# Altium schematic sheet DesignSchematic.SchDoc
size A4
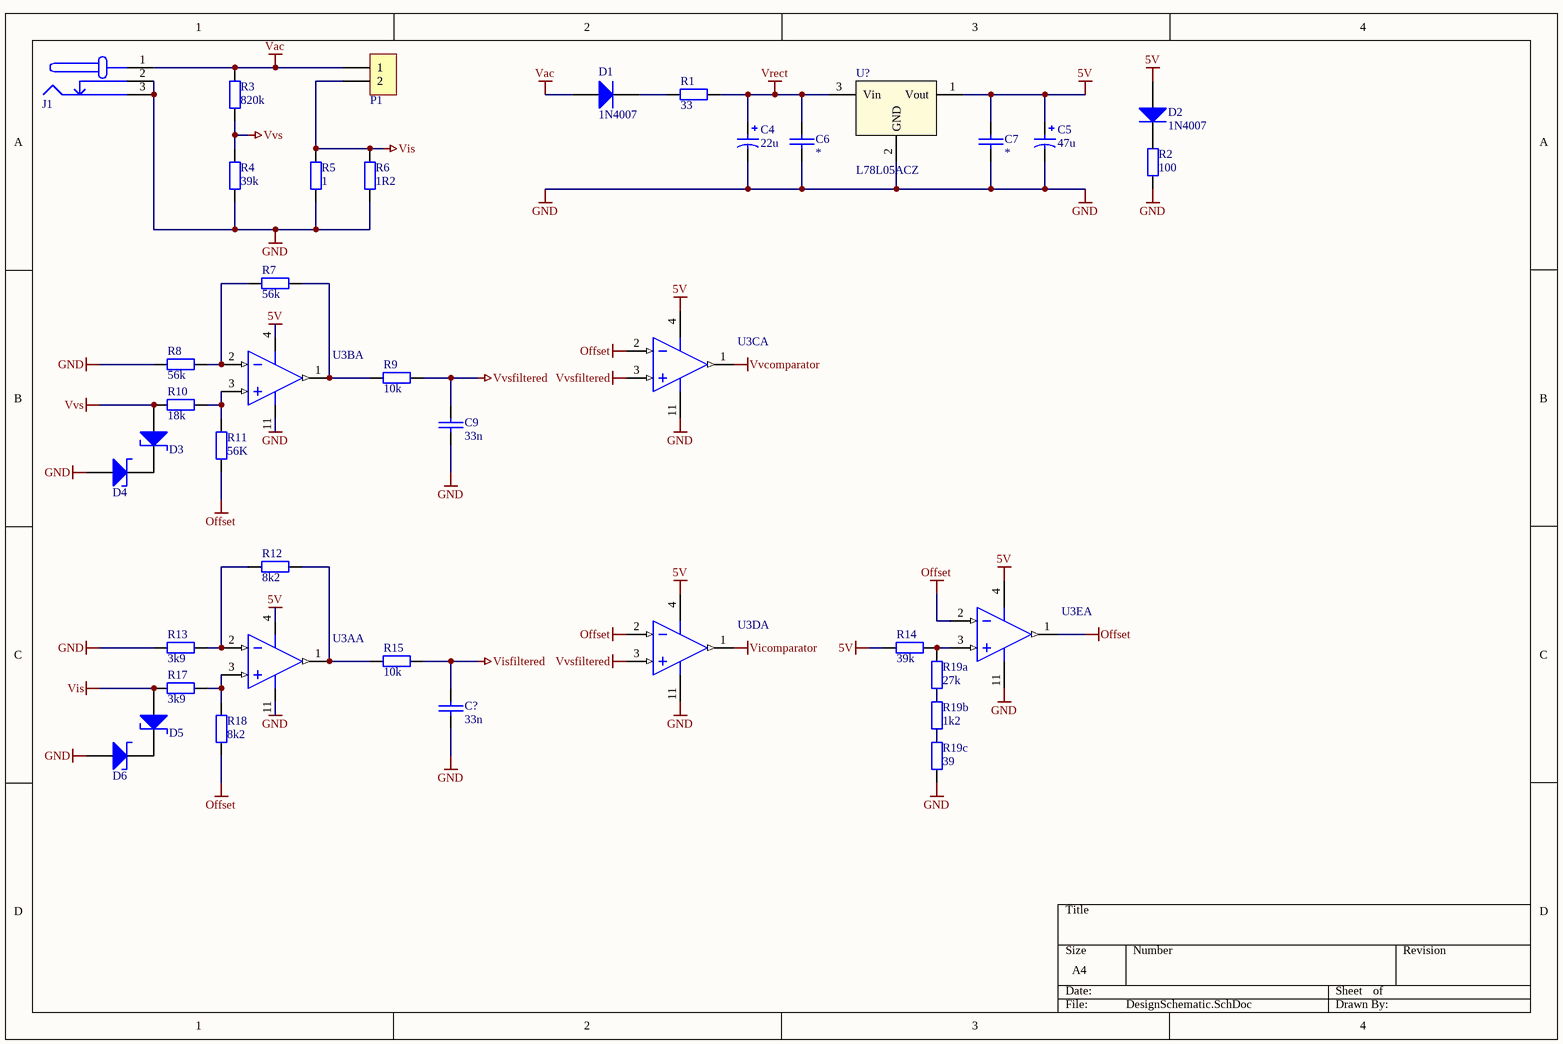
[diagram p0: DesignSchematic.SchDoc]

## Parts
C4  22u  [CAP-RAD-2.5mm Pitch]
C5  47u  [CAP-RAD-2.5mm Pitch]
C6  *  [CCAP-5P0]
C7  *  [CCAP-5P0]
C9  33n  [CCAP-5P0]
C?  33n  [CCAP-5P0]
D1  1N4007  [1N4007-MFG]
D2  1N4007  [1N4007-MFG]
D3  BZX79-CXVX  [AXIAL-Zener-0.4]  (value not drawn)
D4  BZX79-CXVX  [AXIAL-Zener-0.4]  (value not drawn)
D5  BZX79-CXVX  [AXIAL-Zener-0.4]  (value not drawn)
D6  BZX79-CXVX  [AXIAL-Zener-0.4]  (value not drawn)
J1  DC barrel jack  [AC-Socket]  (value not drawn)
P1  Dual Banana Plugs  [Dual Banana Plug]  (value not drawn)
R1  33  [AXIAL-0.4]
R2  100  [AXIAL-0.4]
R3  820k  [AXIAL-0.4]
R4  39k  [AXIAL-0.4]
R5  1  [AXIAL-0.4]
R6  1R2  [AXIAL-0.4]
R7  56k  [AXIAL-0.4]
R8  56k  [AXIAL-0.4]
R9  10k  [AXIAL-0.4]
R10  18k  [AXIAL-0.4]
R11  56K  [AXIAL-0.4]
R12  8k2  [AXIAL-0.4]
R13  3k9  [AXIAL-0.4]
R14  39k  [AXIAL-0.4]
R15  10k  [AXIAL-0.4]
R17  3k9  [AXIAL-0.4]
R18  8k2  [AXIAL-0.4]
R19a  27k  [AXIAL-0.4]
R19b  1k2  [AXIAL-0.4]
R19c  39  [AXIAL-0.4]
U3A  LM324  [DIP-14]  (value not drawn)  (part A of 4)
U3B  LM324  [DIP-14]  (value not drawn)  (part A of 4)
U3C  LM324  [DIP-14]  (value not drawn)  (part A of 4)
U3D  LM324  [DIP-14]  (value not drawn)  (part A of 4)
U3E  LM324  [DIP-14]  (value not drawn)  (part A of 4)
U?  L78L05ACZ  [TO-92]

## Nets
5V: C5.1 C7.1 D2.1(A) R14.1 U3A.4(VDD) U3B.4(VDD) U3C.4(VDD) U3D.4(VDD) U3E.4(VDD) U?.1(Vout)
GND: C4.2 C5.2 C6.2 C7.2 C9.2 C?.2 D4.1(A) D6.1(A) J1.2(GND_ALT) J1.3(GND) R2.1 R4.2 R5.2 R6.2 R8.1 R13.1 R19c.1 U3A.11(VSS) U3B.11(VSS) U3C.11(VSS) U3D.11(VSS) U3E.11(VSS) U?.2(GND)
Offset: R11.1 R18.1 U3C.2(VINA-) U3D.2(VINA-) U3E.1(VOUTA) U3E.2(VINA-)
Vac: D1.1(A) J1.1(VCC) P1.1 R3.1
Vicomparator: U3D.1(VOUTA)
Vis: D5.1(A) P1.2 R5.1 R6.1 R17.1
Visfiltered: C?.1 R15.2
Vrect: C4.1 C6.1 R1.2 U?.3(Vin)
Vvcomparator: U3C.1(VOUTA)
Vvs: D3.1(A) R3.2 R4.1 R10.1
Vvsfiltered: C9.1 R9.2 U3C.3(VINA+) U3D.3(VINA+)
NetD1_2: D1.2(K) R1.1
NetD3_2: D3.2(K) D4.2(K)
NetD5_2: D5.2(K) D6.2(K)
NetR7_1: R7.1 R8.2 U3B.2(VINA-)
NetR7_2: R7.2 R9.1 U3B.1(VOUTA)
NetR10_2: R10.2 R11.2 U3B.3(VINA+)
NetR12_1: R12.1 R13.2 U3A.2(VINA-)
NetR12_2: R12.2 R15.1 U3A.1(VOUTA)
NetR14_2: R14.2 R19a.2 U3E.3(VINA+)
NetR17_2: R17.2 R18.2 U3A.3(VINA+)
NetR19a_1: R19a.1 R19b.2
NetR19b_1: R19b.1 R19c.2

Not connected (* = marked no-connect by the designer): D2 2(K); R2 2

## Library data of the parts
C4 C5 = ElecCap_TH_2P0: Electrolytic capacitor with radial package, 2mm pitch and 5.2mm diameter; Published: 8-Jun-2000; LatestRevisionDate: 17-Jul-2002; LatestRevisionNote: Re-released for DXP Platform.; PackageReference: POLAR0.8; Publisher: Altium Limited; PackageDescription: Polarized Capacitor; 2 Leads; Value: *
C6 C7 C9 C? = CerCap_TH_5P0: SMT ceramic capacitor 0805 size; Value: *
D1 D2 = 1N4007_TH_4AX0: 1N4007 1000V standard axial diode; ComponentLink1URL: https://www.fairchildsemi.com/datasheets/1N/1N914.pdf; ComponentLink1Description: https://www.fairchildsemi.com/datasheets/1N/1N914.pdf; Supplier 1: Digi-Key; Supplier Part Number 1: 1N4007RLGOSCT-ND
D3-D6 = Zener_TH_4AX0: Axial zener diode BZX79 series; Manufacturer: Nexperia USA Inc.; Manufacturer Part Number: BZX79-C4V7,143; Tolerance: ±5%; Supplier 1: Digi-Key; RoHS: RoHS Compliant; Category: Discrete Semiconductor Products; Stock 1: 8933; Pricing 1: 1=0.23, 10=0.206, 100=0.1123, 500=0.06912, 1000=0.04714 (NZD); Packaging: Cut Tape (CT); Part Status: Active; Operating Temperature: -65°C ~ 200°C; Mounting Type: Through Hole; Package / Case: DO-204AH, DO-35, Axial; Supplier Device Package: DO-35; ComponentLink1URL: https://assets.nexperia.com/documents/data-sheet/BZX79.pdf; ComponentLink1Description: https://assets.nexperia.com/documents/data-sheet/BZX79.pdf; Supplier Part Number 1: 1727-1864-1-ND
J1 = AC_Input: DC barrel jack connection to AC source; Value: socket
P1 = AC_Output: Dual banana plugs connection to the AC load; LatestRevisionDate: 17-Jul-2002; LatestRevisionNote: Re-released for DXP Platform.; Publisher: Altium Limited
R1-R15 R17 R18 R19a R19b R19c = Res_TH_0AX4: Through hole resistor; Published: 8-Jun-2000; LatestRevisionDate: 17-Jul-2002; LatestRevisionNote: Re-released for DXP Platform.; PackageReference: AXIAL-0.4; Publisher: Altium Limited; Value: *; ComponentLink1Description: http://www.royalohm.com/pdf/product2017/PrecisionMetalMF.pdf
U3A U3B U3C U3D U3E = LM324N_TH_DIP16: IC OPAMP GP 14DIP; Manufacturer: ON Semiconductor; Manufacturer Part Number: LM324N; Amplifier Type: General Purpose; Current - Supply: 1mA; Voltage - Supply, Single/Dual (±): 3 V ~ 32 V, ±1.5 V ~ 16 V; Supplier 1: Digi-Key; RoHS: RoHS Compliant; Category: Integrated Circuits (ICs); Stock 1: 2900; Pricing 1: 1=0.9, 10=0.775, 100=0.5789, 500=0.45482, 1000=0.35145 (NZD); Packaging: Tube; Part Status: Active; Output Type: -; Slew Rate: -; Operating Temperature: 0°C ~ 70°C; Mounting Type: Through Hole; Package / Case: 14-DIP (0.300", 7.62mm); Supplier Device Package: 14-DIP; Base Part Number: LM324; ComponentLink1URL: https://www.fairchildsemi.com/datasheets/LM/LM2902.pdf; ComponentLink1Description: https://www.fairchildsemi.com/datasheets/LM/LM2902.pdf; Supplier Part Number 1: LM324NFS-ND
U? = L78L05_TH_TO92: Voltage Regulator 5V; Manufacturer: ON Semiconductor; Manufacturer Part Number: LM78L05ACZX; Output Configuration: Positive; Output Type: Fixed; Voltage - Input (Max): 30V; Current - Output: 100mA; PSRR: 80dB (120Hz); Protection Features: Over Temperature, Short Circuit; Supplier 1: Digi-Key; RoHS: RoHS Compliant; Category: Integrated Circuits (ICs); Stock 1: 7782; Pricing 1: 1=0.69, 10=0.517, 100=0.3226, 500=0.2207, 1000=0.16976 (NZD); Packaging: Cut Tape (CT); Part Status: Active; Voltage - Output (Min/Fixed): 5V; Voltage - Output (Max): -; Voltage Dropout (Max): -; Control Features: -; Operating Temperature: -40°C ~ 125°C; Mounting Type: Through Hole; Package / Case: TO-226-3, TO-92-3 (TO-226AA) (Formed Leads); Supplier Device Package: TO-92-3; Base Part Number: LM78L05; ComponentLink1URL: https://www.fairchildsemi.com/datasheets/MC/MC78L05A.pdf; ComponentLink1Description: https://www.fairchildsemi.com/datasheets/MC/MC78L05A.pdf; Supplier Part Number 1: LM78L05ACZXCT-ND